# EAGLE design skill_test (EAGLE 9.6.1)
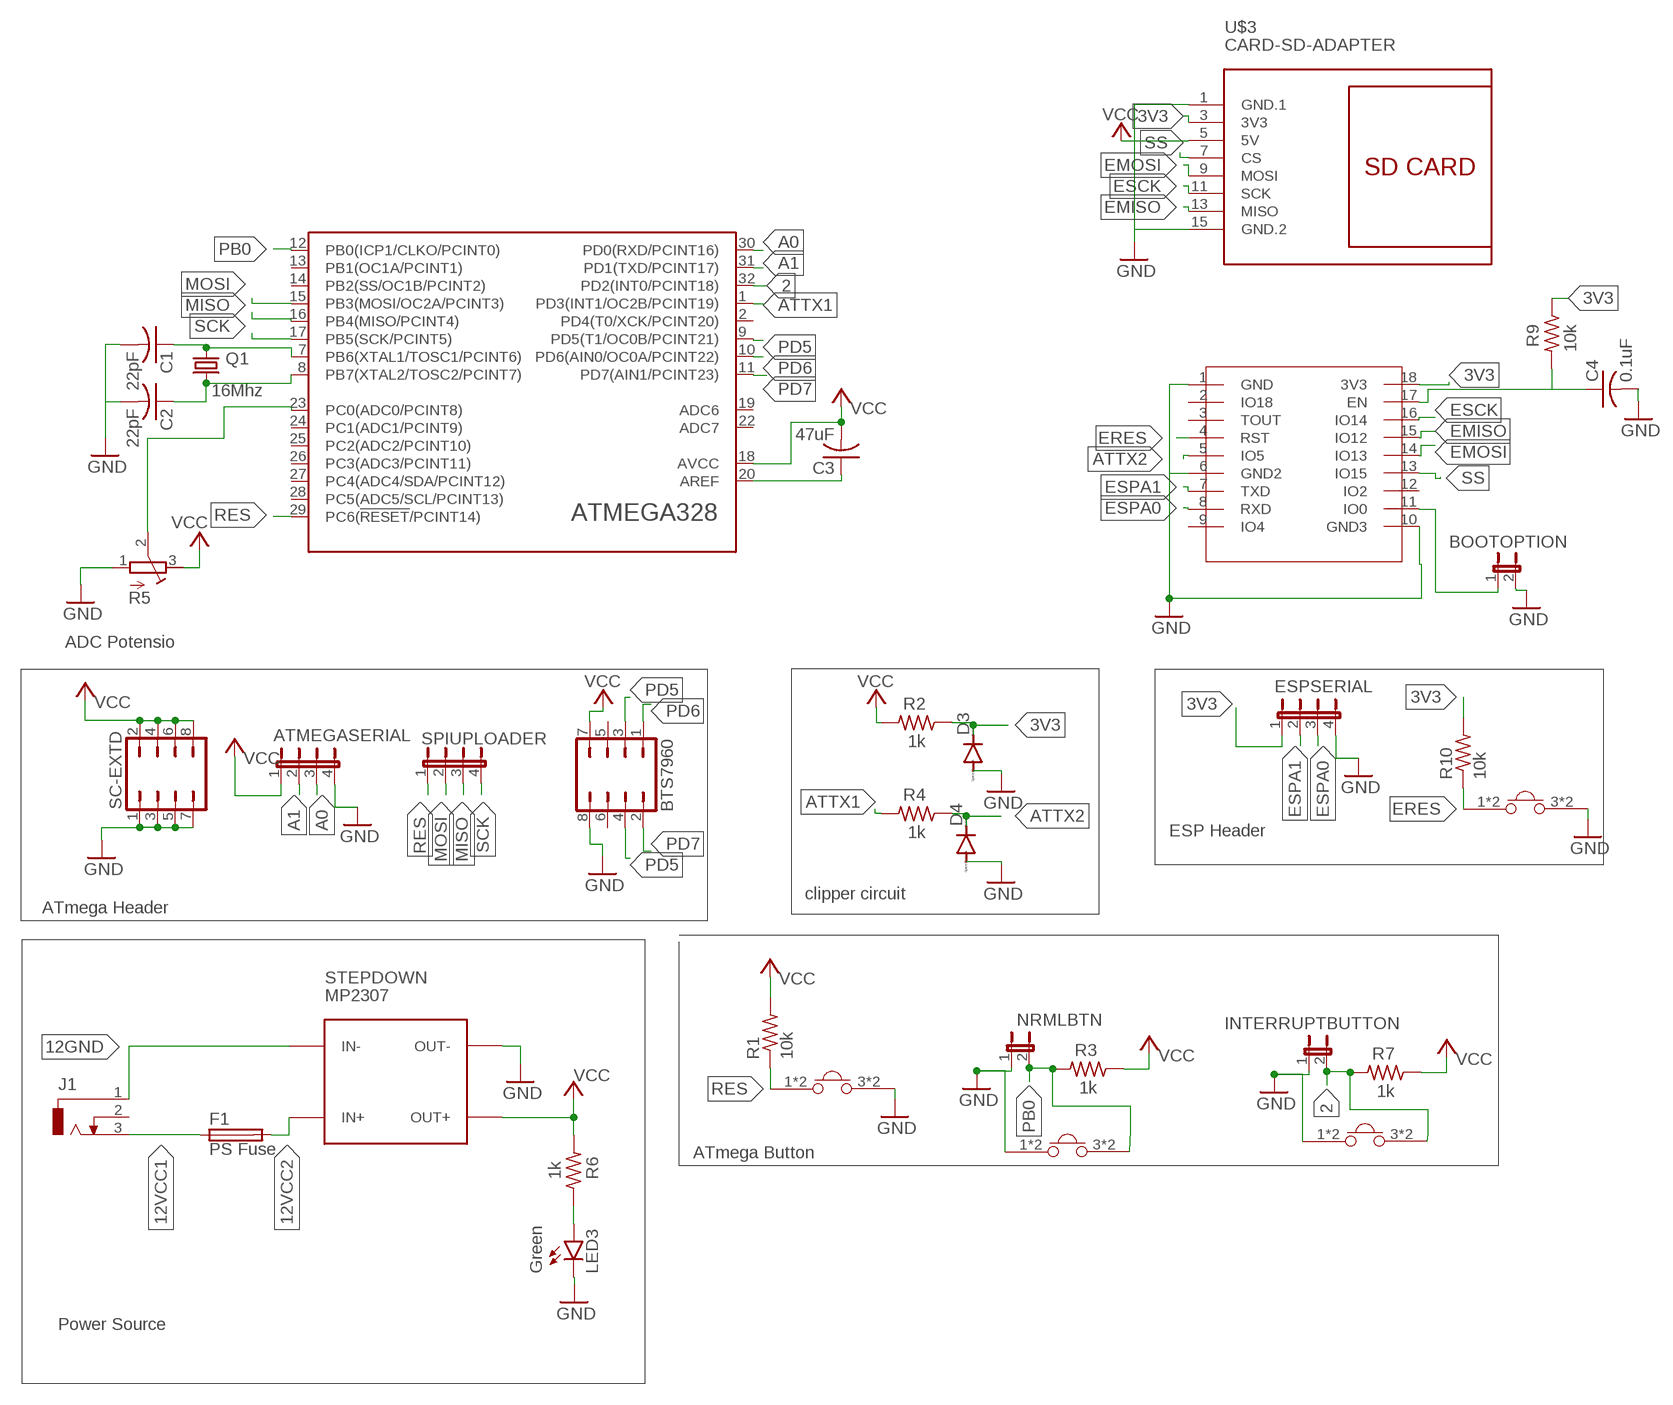
[diagram p0: schematic, sheet 1]

## Parts
2  SMD-PUSHBUTTON  [SMD-PUSHBUTTON]
ATMEGA328  ATMEGA48/88/168/328-AU  [TQFP32-08]
ATMEGASERIAL  JP4E  [JP4]
BOOTOPTION  JP1E  [JP1]
BTS7960  JP4Q  [JP4Q]
C1  22pF  C-USC0805  [C0805]
C2  22pF  C-USC0805  [C0805]
C3  47uF  C-USC0805  [C0805]
C4  0.1uF  C-US025-024X044  [C025-024X044]
D3  BAT81  [DO34-7]
D4  BAT81  [DO34-7]
ESPSERIAL  JP4E  [JP4]
F1  PS Fuse  FUSEBLANK_5X20MM  [FUSE_HOLDER_5X20MM]
INTERRUPTBUTTON  JP1E  [JP1]
J1  DCJ0303  [DCJ0303]
LED3  Green  LED3MM  [LED3MM]
NRMLBTN  JP1E  [JP1]
PB0  SMD-PUSHBUTTON  [SMD-PUSHBUTTON]
Q1  16Mhz  CRYSTALHC49UP  [HC49UP]
R1  10k  R-US_R0805  [R0805]
R2  1k  R-US_0204/7  [0204/7]
R3  1k  R-US_0204/7  [0204/7]
R4  1k  R-US_0204/7  [0204/7]
R5  R-TRIMM64W  [RTRIM64W]
R6  1k  R-US_0204/7  [0204/7]
R7  1k  R-US_0204/7  [0204/7]
R9  10k  R-US_0204/7  [0204/7]
R10  10k  R-US_R0805  [R0805]
RES  SMD-PUSHBUTTON  [SMD-PUSHBUTTON]
SC-EXTD  JP4Q  [JP4Q]
SPIUPLOADER  JP4E  [JP4]
STEPDOWN  MP2307  DC-DC-STEP-DOWN-MP2307  [DC-DC-STEP-DOWN-MP2307]
U$1  ESP-WROOM-02  [ESP-WROOM-02]
U$3  CARD-SD-ADAPTER  [CARD-SD-ADAPTER]
U$6  SMD-PUSHBUTTON  [SMD-PUSHBUTTON]

## Nets
2: 2.3 2.4 ATMEGA328.32(PD2(INT0/PCINT18)) INTERRUPTBUTTON.2 R7.2
3V3 [VCC]: D3.C ESPSERIAL.1 R2.1 R9.1 R10.2 U$1.18(3V3) U$3.3(3V3)
12GND [GND]: J1.1 STEPDOWN.IN-
12VCC1 [VCC]: F1.1 J1.3
12VCC2 [VCC]: F1.2 STEPDOWN.IN+
A0: ATMEGA328.30(PD0(RXD/PCINT16)) ATMEGASERIAL.3
A1: ATMEGA328.31(PD1(TXD/PCINT17)) ATMEGASERIAL.2
ATTX1: ATMEGA328.1(PD3(INT1/OC2B/PCINT19)) R4.2
ATTX2: D4.C R4.1 U$1.5(IO5)
EMISO: U$1.15(IO12) U$3.13(MISO)
EMOSI: U$1.14(IO13) U$3.9(MOSI)
ERES: R10.1 U$1.4(RST) U$6.1 U$6.2
ESCK: U$1.16(IO14) U$3.11(SCK)
ESPA0: ESPSERIAL.3 U$1.8(RXD)
ESPA1: ESPSERIAL.2 U$1.7(TXD)
GND [GND]: 2.1 2.2 ATMEGASERIAL.4 BOOTOPTION.2 BTS7960.8 C1.2 C2.2 C4.2 D3.A D4.A ESPSERIAL.4 INTERRUPTBUTTON.1 LED3.K(C) NRMLBTN.1 PB0.1 PB0.2 R5.1(A) RES.3 RES.4 SC-EXTD.1 SC-EXTD.3 SC-EXTD.5 SC-EXTD.7 STEPDOWN.OUT- U$1.1(GND) U$1.6(GND2) U$1.10(GND3) U$3.1(GND.1) U$3.15(GND.2) U$6.3 U$6.4
MISO: ATMEGA328.16(PB4(MISO/PCINT4)) SPIUPLOADER.3
MOSI: ATMEGA328.15(PB3(MOSI/OC2A/PCINT3)) SPIUPLOADER.2
N$1: LED3.A R6.1
N$5: ATMEGA328.20(AREF) C3.1
N$6: ATMEGA328.8(PB7(XTAL2/TOSC2/PCINT7)) C2.1 Q1.2
N$7: ATMEGA328.7(PB6(XTAL1/TOSC1/PCINT6)) C1.1 Q1.1
N$8: ATMEGA328.23(PC0(ADC0/PCINT8)) R5.2(S)
N$10: BOOTOPTION.1 U$1.11(IO0)
N$13: C4.1 R9.2 U$1.17(EN)
PB0: ATMEGA328.12(PB0(ICP1/CLKO/PCINT0)) NRMLBTN.2 PB0.3 PB0.4 R3.2
PD5: ATMEGA328.9(PD5(T1/OC0B/PCINT21)) BTS7960.3 BTS7960.4
PD6: ATMEGA328.10(PD6(AIN0/OC0A/PCINT22)) BTS7960.1
PD7: ATMEGA328.11(PD7(AIN1/PCINT23)) BTS7960.2
RES: ATMEGA328.29(PC6(!RESET!/PCINT14)) R1.1 RES.1 RES.2 SPIUPLOADER.1
SCK: ATMEGA328.17(PB5(SCK/PCINT5)) SPIUPLOADER.4
SS: U$1.13(IO15) U$3.7(CS)
VCC [VCC]: ATMEGA328.18(AVCC) ATMEGASERIAL.1 BTS7960.7 C3.2 R1.2 R2.2 R3.1 R5.3(E) R6.2 R7.1 SC-EXTD.2 SC-EXTD.4 SC-EXTD.6 SC-EXTD.8 STEPDOWN.OUT+ U$3.5(5V)
Unconnected: ATMEGA328.2(PD4(T0/XCK/PCINT20)) ATMEGA328.13(PB1(OC1A/PCINT1)) ATMEGA328.14(PB2(SS/OC1B/PCINT2)) ATMEGA328.19(ADC6) ATMEGA328.22(ADC7) ATMEGA328.24(PC1(ADC1/PCINT9)) ATMEGA328.25(PC2(ADC2/PCINT10)) ATMEGA328.26(PC3(ADC3/PCINT11)) ATMEGA328.27(PC4(ADC4/SDA/PCINT12)) ATMEGA328.28(PC5(ADC5/SCL/PCINT13)) BTS7960.5 BTS7960.6 J1.2 U$1.2(IO18) U$1.3(TOUT) U$1.9(IO4) U$1.12(IO2)

## Notes on the sheet
- ADC Potensio
- ESP Header
- clipper circuit
- ATmega Header
- ATmega Button
- Power Source

## Power pins joined to a net without a drawn wire
GND: ATMEGA328.3(GND) ATMEGA328.5(GND) ATMEGA328.21(GND)
UCC: ATMEGA328.4(UCC) ATMEGA328.6(UCC)

## Library data of the parts
2 PB0 RES U$6 = additionlib:SMD-PUSHBUTTON
ATMEGA328 = atmega328:ATMEGA48/88/168/328
ATMEGASERIAL ESPSERIAL SPIUPLOADER = jumper:JP4E: JUMPER
BOOTOPTION INTERRUPTBUTTON NRMLBTN = jumper:JP1E: JUMPER
BTS7960 SC-EXTD = jumper:JP4Q: JUMPER
C1-C4 = rcl:C-US: CAPACITOR, American symbol; SPICEPREFIX: C
D3 D4 = diode:BAT81: DIODE barrier diode
F1 = fuse:FUSE: Fuse; OC_FARNELL: unknown; OC_NEWARK: unknown
J1 = con-jack:DCJ0303: DC POWER JACK Source: DCJ0303.pdf; OC_FARNELL: unknown; OC_NEWARK: unknown
LED3 = led:LED: LED OSRAM: - CHIPLED LG R971, LG N971, LY N971, LG Q971, LY Q971, LO R971, LY R971 LH N974, LH R974 LS Q976, LO Q976, LY Q976 LO Q996 - Hyper CHIPLED LW Q18S LB Q993, LB Q99A, LB R99A - SideLED LS A670, LO A670, LY A670, LG A670, LP A670 LB A673, LV A673, LT A673, LW A673 LH A674 LY A675 LS A676, LA A676, LO A676, LY A676, LW A676 LS A679, LY A679, LG A679 - Hyper Micro SIDELED® LS Y876, LA Y876, LO Y876, LY Y876 LT Y87S - SmartLED LW L88C, LW L88S LB L89C, LB L89S, LG L890 LS L89K, LO L89K, LY L89K LS L896, LA L896, LO L896, LY L896 - TOPLED LS T670, LO T670, LY T670, LG T670, LP T670 LSG T670, LSP T670, LSY T670, LOP T670, LYG T670 LG T671, LOG T671, LSG T671 LB T673, LV T673, LT T673, LW T673 LH T674 LS T676, LA T676, LO T676, LY T676, LB T676, LH T676, LSB T676, LW T676 LB T67C, LV T67C, LT T67C, LS T67K, LO T67K, LY T67K, LW E67C LS E67B, LA E67B, LO E67B, LY E67B, LB E67C, LV E67C, LT E67C LW T67C LS T679, LY T679, LG T679 LS T770, LO T770, LY T770, LG T770, LP T770 LB T773, LV T773, LT T773, LW T773 LH T774 LS E675, LA E675, LY E675, LS T675 LS T776, LA T776, LO T776, LY T776, LB T776 LHGB T686 LT T68C, LB T68C - Hyper Mini TOPLED® LB M676 - Mini TOPLED Santana® LG M470 LS M47K, LO M47K, LY M47K Source: http://www.osram.convergy.de LUXEON: - LUMILED® LXK2-PW12-R00, LXK2-PW12-S00, LXK2-PW14-U00, LXK2-PW14-V00 LXK2-PM12-R00, LXK2-PM12-S00, LXK2-PM14-U00 LXK2-PE12-Q00, LXK2-PE12-R00, LXK2-PE12-S00, LXK2-PE14-T00, LXK2-PE14-U00 LXK2-PB12-K00, LXK2-PB12-L00, LXK2-PB12-M00, LXK2-PB14-N00, LXK2-PB14-P00, LXK2-PB14-Q00 LXK2-PR12-L00, LXK2-PR12-M00, LXK2-PR14-Q00, LXK2-PR14-R00 LXK2-PD12-Q00, LXK2-PD12-R00, LXK2-PD12-S00 LXK2-PH12-R00, LXK2-PH12-S00 LXK2-PL12-P00, LXK2-PL12-Q00, LXK2-PL12-R00 Source: www.luxeon.com KINGBRIGHT: KA-3528ASYC Source: www.kingbright.com
Q1 = crystal:CRYSTAL: CRYSTAL; OC_FARNELL: unknown; OC_NEWARK: unknown
R1-R4 R6 R7 R9 R10 = rcl:R-US_: RESISTOR, American symbol; SPICEPREFIX: R
R5 = rcl:R-TRIMM: Trimm resistor; SPICEMODEL: X; SPICEPREFIXL: POT
STEPDOWN = diy-modules:DC-DC-STEP-DOWN-MP2307: DC/DC Step-Down Regulator based on MP2307DN chip MP2307 datasheet available here: https://cdn-shop.adafruit.com/datasheets/MP2307_r1.9.pdf Click here to find device on ebay.com <http://www.ebay.com/sch/dc+dc+3a+mini+converter>
U$1 = additionlib:ESP-WROOM-02
U$3 = diy-modules:CARD-SD-ADAPTER: Full Size SD Card Adapter Module with onboard 3.3V regulator Guide describing how to use SD card with Arduino is available here: https://www.arduino.cc/en/Reference/SDCardNotes Click here to find device on ebay.com <http://www.ebay.com/sch/sd+card+socket+module>

## Net classes
0 default: width 0.254 mm, clearance 0.254 mm
1 GND: width 0.381 mm, clearance 0.254 mm
2 VCC: width 0.381 mm, clearance 0.254 mm

## Board
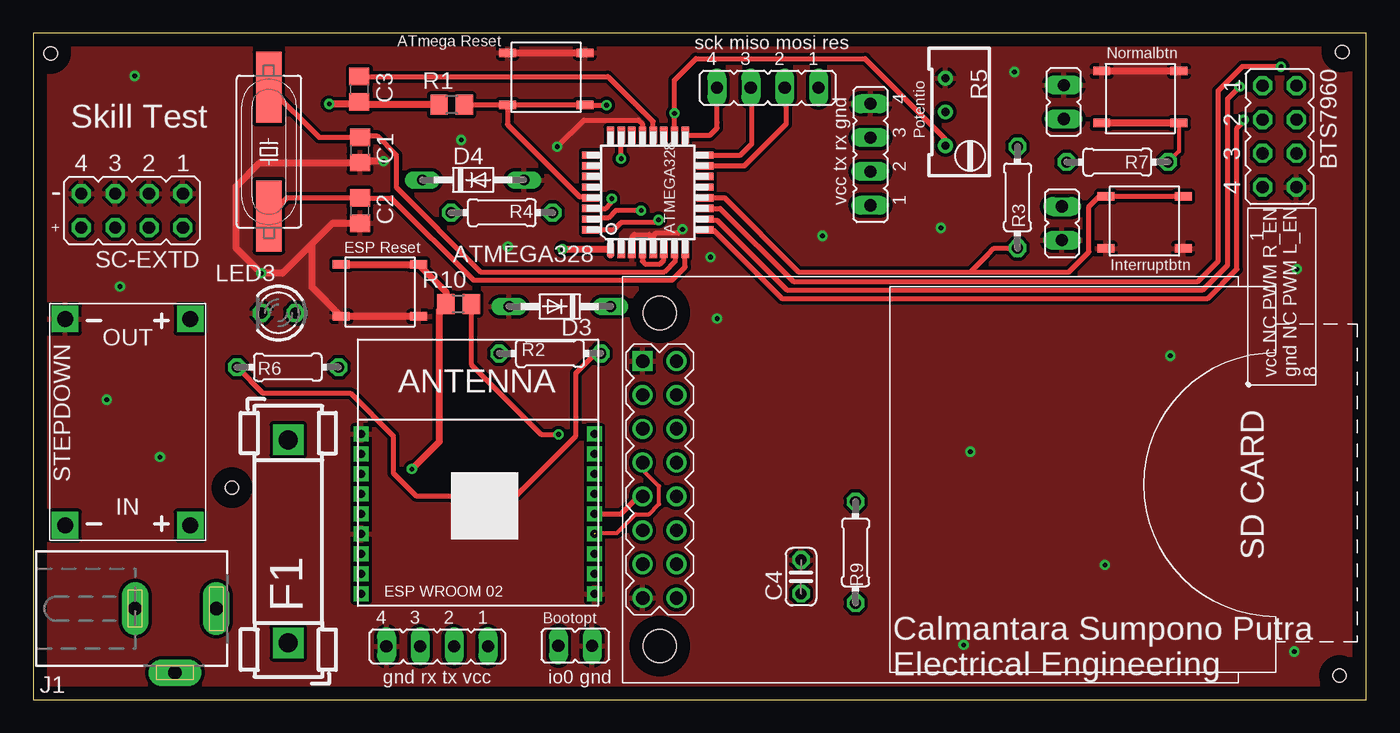
[diagram p1: board, top side]
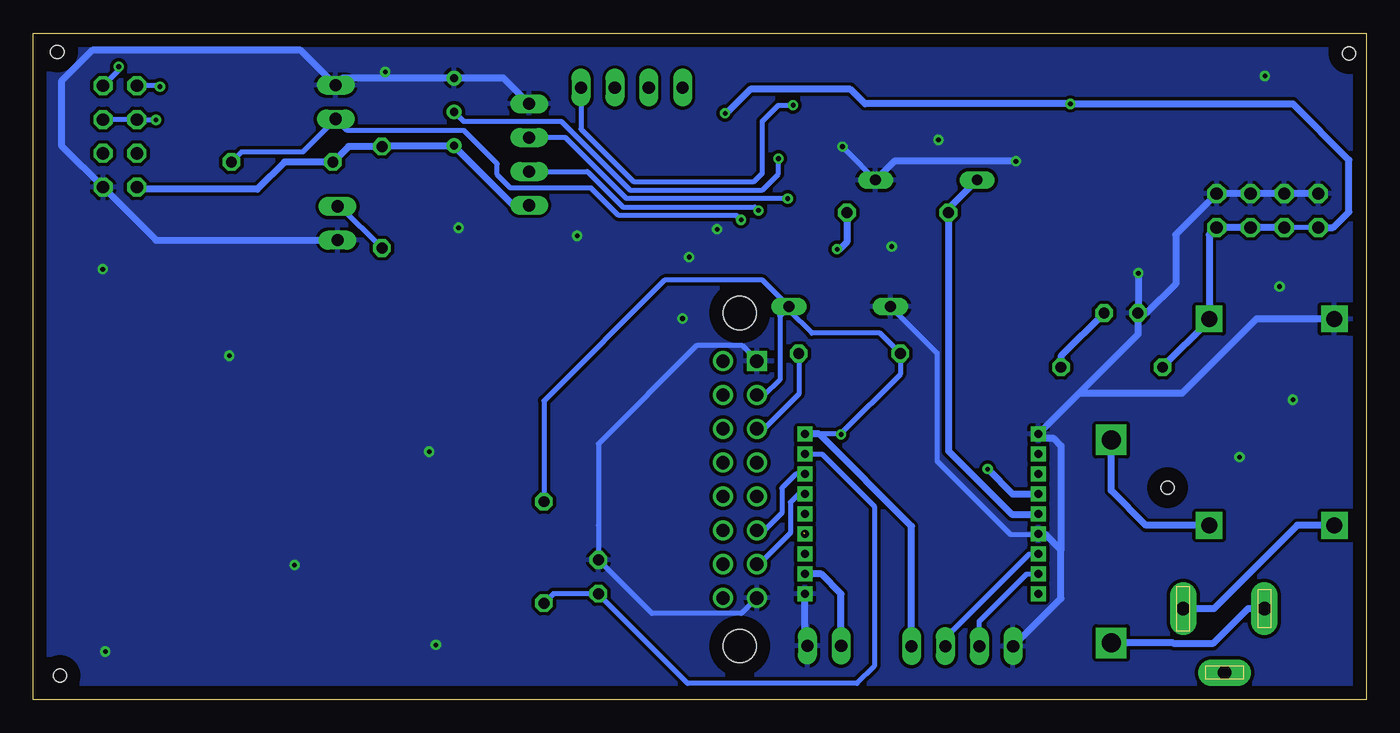
[diagram p2: board, bottom side, seen from below]

Size 100 x 50 mm. Coordinates in mm from the lower left corner, seen from the top.
Outline: 0,0 100,0 100,50 0,50 0,0
Copper layers (1*16): Top 0.035mm / dielectric 1.5mm / Bottom 0.035mm
Design rules "default": minimum track width 6mil, minimum drill 0.35mm, track to track 6mil, track to pad 6mil, pad to pad 6mil, via to via 6mil, smd to smd 6mil, copper to edge 40mil, drill to drill 6mil, minimum pad ring 10mil, minimum via ring 8mil, stop-mask expansion 4mil, vias tented up to drill 0mil, thermal gap 10mil
Holes 1 mm at 98,1.8 98.2,48.6 1.3,48.5 14.9,15.9

### Footprints (pad centres in the part's own frame; a part is rotated, then mirrored left to right if it is on the bottom)
SMD-PUSHBUTTON = smd 1.27 x 0.635: 1 -2.3,2.45; 2 3.5,2.45; 3 -2.3,-1.45; 4 3.5,-1.45
TQFP32-08 = smd 1.27 x 0.55: 1 -4.293,2.8; 2 -4.293,2; 3 -4.293,1.2; 4 -4.293,0.4; 5 -4.293,-0.4; 6 -4.293,-1.2; 7 -4.293,-2; 8 -4.293,-2.8; 17 4.293,-2.8; 18 4.293,-2; 19 4.293,-1.2; 20 4.293,-0.4; 21 4.293,0.4; 22 4.293,1.2; 23 4.293,2; 24 4.293,2.8 | smd 0.55 x 1.27: 9 -2.8,-4.293; 10 -2,-4.293; 11 -1.2,-4.293; 12 -0.4,-4.293; 13 0.4,-4.293; 14 1.2,-4.293; 15 2,-4.293; 16 2.8,-4.293; 25 2.8,4.293; 26 2,4.293; 27 1.2,4.293; 28 0.4,4.293; 29 -0.4,4.293; 30 -1.2,4.293; 31 -2,4.293; 32 -2.8,4.293
JP4 = drill 0.914 long: 1 -3.81,0; 2 -1.27,0; 3 1.27,0; 4 3.81,0
JP1 = drill 0.914 long: 1 0,-1.27; 2 0,1.27
JP4Q = drill 0.914 octagon: 1 -3.81,-1.27; 2 -3.81,1.27; 3 -1.27,-1.27; 4 -1.27,1.27; 5 1.27,-1.27; 6 1.27,1.27; 7 3.81,-1.27; 8 3.81,1.27
C0805 = smd 1.3 x 1.5: 1 -0.95,0; 2 0.95,0
C025-024X044 = drill 0.813 octagon: 1 -1.27,0; 2 1.27,0
DO34-7 = drill 0.813 long: A 3.81,0; C -3.81,0
FUSE_HOLDER_5X20MM = drill 1.422 pad 2.286 square: 1 0,0; 2 15.24,0
DCJ0303 = drill 1 pad 2 long: 1 0,3.1; 2 4.8,0; 3 0,-3
LED3MM = drill 0.813 octagon: A -1.27,0; K 1.27,0
HC49UP = smd 5.334 x 1.93: 1 -4.826,0; 2 4.826,0
R0805 = smd 1.3 x 1.5: 1 -0.95,0; 2 0.95,0
0204/7 = drill 0.813 octagon: 1 -3.81,0; 2 3.81,0
RTRIM64W = drill 0.61: 1 1.27,-2.54; 2 1.27,0; 3 1.27,2.54
DC-DC-STEP-DOWN-MP2307 = drill 1.2 pad 2 square: IN+ -7.747,-4.699; IN- -7.747,4.699; OUT+ 7.747,-4.699; OUT- 7.747,4.699
ESP-WROOM-02 = drill 0.6 square: 1 -7.75,-4.1; 2 -7.75,-5.6; 3 -7.75,-7.1; 4 -7.75,-8.6; 5 -7.75,-10.1; 6 -7.75,-11.6; 7 -7.75,-13.1; 8 -7.75,-14.6; 9 -7.75,-16.1; 10 9.75,-16.1; 11 9.75,-14.6; 12 9.75,-13.1; 13 9.75,-11.6; 14 9.75,-10.1; 15 9.75,-8.6; 16 9.75,-7.1; 17 9.75,-5.6; 18 9.75,-4.1
CARD-SD-ADAPTER = drill 1 square: 1 -21.59,8.89 | drill 1: 2 -19.05,8.89; 3 -21.59,6.35; 4 -19.05,6.35; 5 -21.59,3.81; 6 -19.05,3.81; 7 -21.59,1.27; 8 -19.05,1.27; 9 -21.59,-1.27; 10 -19.05,-1.27; 11 -21.59,-3.81; 12 -19.05,-3.81; 13 -21.59,-6.35; 14 -19.05,-6.35; 15 -21.59,-8.89; 16 -19.05,-8.89 | hole 2.5: -20.32,12.5; -20.32,-12.5

### Placement (x,y rotation side)
2  82.45,44.71 0 top
ATMEGA328  46.1,38.06 90 top
ATMEGASERIAL  62.8,40.9 90 top
BOOTOPTION  40.66,4.03 270 top
BTS7960  93.5,42.26 270 top
C1  24.5,41.24 270 top
C2  24.5,36.69 270 top
C3  24.46,45.81 270 top
C4  57.6,9.21 90 top
D3  39.5,29.5 180 top
D4  33,39 0 top
ESPSERIAL  30.3,4 180 top
F1  19.13,4.25 90 top
INTERRUPTBUTTON  77.31,44.84 180 top
J1  10.63,6.82 270 top
LED3  18.39,29.01 180 top
NRMLBTN  77.18,35.74 0 top
PB0  83.97,36.31 180 top
Q1  17.67,41.12 270 top
R1  31.39,44.64 180 top
R2  38.76,25.97 0 top
R3  73.84,37.69 270 top
R4  35.15,36.54 0 top
R5  69.7,44.1 180 top
R6  19.09,24.94 180 top
R7  81.33,40.34 0 top
R9  61.69,11.04 270 top
R10  31.9,29.7 0 top
RES  39.08,47.09 180 top
SC-EXTD  7.41,36.7 180 top
SPIUPLOADER  55.1,45.93 180 top
STEPDOWN  7.08,20.82 90 top
U$1  32.35,24.03 0 top
U$3  67.31,16.51 0 top
U$6  25.4,30.2 0 top

### Tracks (layer width: path | path; a pad name or v marks a point on that pad's centre or on a via)
2  (via drill 0.35)
  Top 0.305: 2.4 85.95,41.15 R7.2
  Top 0.381: ATMEGA328.32 43.56,35.26 44.1,35.8 46.7,35.8 v46.9,36
  Top 0.508: 2.4 2.3
  Bottom 0.381: v46.9,36 47.23,36.33 56.08,36.33 58.15,38.4 64.2,38.4 65.2,39.4 65.2,40.2 67.7,42.7 76.44,42.7 INTERRUPTBUTTON.2 79.78,41.1 84.38,41.1 R7.2
3V3  (via drill 0.35)
  Top 0.381: R10.2 32.85,25.15 38.1,19.9 v39.4,19.9
  Bottom 0.381: v39.4,19.9 39.43,19.93 | 39.43,19.93 U$1.18 | U$3.3 45.14,22.86 44,24 44,28.8 D3.C | D3.C 43.31,29.21 41.6,27.5 36.48,27.5 R2.1 34.95,24.41 39.43,19.93 | D3.C | D3.C 45.29,31.47 52.63,31.47 61.69,22.41 R9.1
  Bottom 0.508: ESPSERIAL.1 34.11,13.01 41.03,19.93 U$1.18
12GND
  Bottom 0.508: STEPDOWN.IN- 5.18,13.07 11.43,6.82 J1.1
12VCC1
  Bottom 0.508: J1.3 8.88,6.82 11.52,4.18 14.41,4.18 14.47,4.25 F1.1
12VCC2
  Bottom 0.508: STEPDOWN.IN+ 16.51,13.07 19.13,15.69 F1.2
A0  (via drill 0.35)
  Top 0.381: ATMEGA328.30 42.96,36.86 43.3,37.2 43.3,37.5 v43.4,37.6
  Bottom 0.381: v43.4,37.6 55.5,37.6 60.07,42.17 ATMEGASERIAL.3
A1  (via drill 0.35)
  Top 0.381: v45.6,36.7 43.7,36.7 43.14,36.14 41.89,36.14 ATMEGA328.31
  Bottom 0.381: ATMEGASERIAL.2 58.43,39.63 55.77,36.97 45.87,36.97 v45.6,36.7
ATTX1  (via drill 0.35)
  Top 0.508: v39.7,33.8 43.27,33.8 ATMEGA328.1
  Bottom 0.508: R4.2 38.96,34.34 39.5,33.8 v39.7,33.8
ATTX2
  Bottom 0.508: D4.C 31.34,36.85 R4.1 31.34,18.64 26.6,13.9 24.63,13.9 U$1.5
EMISO
  Bottom 0.381: U$1.15 42.57,15.43 43.2,14.8 43.2,12.5 45.54,10.16 U$3.13
EMOSI
  Top 0.381: U$1.14 44.11,13.93 45.42,15.24 U$3.9
ERES  (via drill 0.35)
  Top 0.508: U$6.1 U$6.2 30.95,30.6 R10.1 30.45,29.2 30.45,19.35 v28.4,17.3
  Bottom 0.508: v28.4,17.3 26.53,15.43 U$1.4
ESCK
  Bottom 0.381: U$1.16 42.77,16.93 43.84,15.87 43.84,14 45.13,12.7 U$3.11
ESPA0
  Bottom 0.381: ESPSERIAL.3 29.03,5.87 25.47,9.43 U$1.8
ESPA1
  Bottom 0.381: ESPSERIAL.2 31.57,4.63 25.27,10.93 U$1.7
GND  (via drill 0.35)
  Top 0.381: v39.3,41.5 41.3,43.5 45.4,43.5 45.7,43.2 ATMEGA328.21 | ATMEGA328.3 44.9,34.7 45.1,34.9 46.2,34.9 46.35,34.75 | ATMEGA328.5 46.5,34.6 46.35,34.75 | 46.35,34.75 46.45,34.75 46.7,35 48.4,35 v48.7,35.3
  Top 0.508: U$6.4 U$6.3 20.9,30.95 20.9,34.2 | RES.4 RES.3 | 2.2 2.1 | C2.2 22.44,35.74 20.9,34.2 | 20.9,34.2 18.7,32 v17.1,32 15.2,33.9 15.2,38.5 16.99,40.29 C1.2 24.61,40.4 v26.27,40.4
  Bottom 0.381: 41.93,3.03 BOOTOPTION.2 | D4.A 38.9,41.09 38.9,41.1 v39.3,41.5 | U$3.15 46.87,6.47 53.59,6.47 C4.2 | D3.A 32.2,26.01 32.2,17.9 26.7,12.4 24.63,12.4 U$1.6 | 57.6,13.1 C4.2 | U$3.1 45.72,25.47 46.8,26.55 50.25,26.55 57.6,19.2 C4.2
  Bottom 0.508: NRMLBTN.1 90.79,34.47 BTS7960.8 97.9,41.58 97.9,46.4 95.57,48.73 79.93,48.73 INTERRUPTBUTTON.1 76.78,46.64 R5.1 64.73,46.64 ATMEGASERIAL.4 | SC-EXTD.7 SC-EXTD.1 14.3,34.89 14.3,31.2 16.49,29.01 LED3.K | BOOTOPTION.2 42.1,4.2 U$1.10 | ESPSERIAL.4 22.9,7.59 22.9,11.24 | 22.9,11.24 24.09,12.43 U$1.6 | 22.9,11.24 22.9,19.04 23.48,19.62 24.29,19.62 U$1.1 21.53,23 | 21.53,23 13.8,23 8.23,28.57 STEPDOWN.OUT- | LED3.K 17.1,29.03 v17.1,32 | D4.A 35.41,40.4 v26.27,40.4 | LED3.K 17.12,27.41 21.53,23
  other vias: 51.3,28.6 50.8,33.2 32.1,42 7.6,46.8 6.5,31 5.5,22.5 9.5,18.2 70.3,18.6 35.6,34 59.2,34.8 68.1,35.4 73.6,47.1 85.3,25.8 94.8,32.3 69.8,4.1 80.4,10.1 94.6,3.6
  pour Bottom: 101.1,50.9 101.2,51 101.2,-0.1 -0.9,-0.1 -1.7,0.7 -1.7,50.3
  pour Top: -1.5,51.6 100.8,51.6 102,50.4 102.5,49.9 102.5,-0.5 101.4,-1.6 -1.5,-1.6 -1.5,51.5
MISO
  Top 0.381: ATMEGA328.16 53.06,40.86 53.9,41.7 53.9,43.4
  Top 0.384: 53.9,43.4 53.9,45.86 SPIUPLOADER.3
  Bottom 0.381: 53.9,45.86 SPIUPLOADER.3
MOSI
  Top 0.381: ATMEGA328.15 53.36,40.06 56.5,43.2 56.5,43.3
  Top 0.384: 56.5,43.3 56.5,45.8 SPIUPLOADER.2
  Bottom 0.381: 56.5,45.8 SPIUPLOADER.2
N$1
  Bottom 0.508: LED3.A 22.9,25.77 R6.1
N$5
  Top 0.381: C3.1 43.11,46.76 46.5,43.37 ATMEGA328.20
N$6
  Top 0.381: ATMEGA328.8 48.9,32.47 47.9,31.47 33.03,31.47 26.86,37.64 C2.1 19.02,37.64 Q1.2
N$7
  Top 0.381: Q1.1 21.43,42.19 C1.1 24.62,42.31 25.79,42.31 27.23,40.87 27.23,38.44 33.57,32.1 47.35,32.1 48.15,32.9 48.15,33.72 ATMEGA328.7
N$8  (via drill 0.35)
  Top 0.381: v44.1,40.6 ATMEGA328.23
  Bottom 0.381: R5.2 67.73,43.4 60.4,43.4 55.23,38.23 45.3,38.23 44.1,39.44 v44.1,40.6
N$10
  Bottom 0.508: U$1.11 42.09,9.42 40.88,9.42 39.39,7.93 BOOTOPTION.1
N$13
  Bottom 0.381: R9.2 60.98,7.94 C4.1 57.6,7.9 50.91,1.21 38.19,1.21 36.9,2.5 36.9,14.5 40.83,18.43 U$1.17
PB0
  Top 0.381: ATMEGA328.12 51.84,37.66 57.4,32.1 70.3,32.1 | 70.3,32.1 71.6,33.4 72.08,33.88 | 70.3,32.1 77.7,32.1 79.2,33.6 79.2,37 79.96,37.76 PB0.4 PB0.3
  Top 0.384: 72.08,33.88 R3.2
  Bottom 0.381: R3.2 76.97,37.01
  Bottom 0.508: 76.97,37.01 NRMLBTN.2
PD5  (via drill 0.35)
  Top 0.381: ATMEGA328.9 50.99,35.26 56.15,30.1 88.1,30.1 90.3,32.3 90.3,42.9 90.8,43.4 v90.8,43.5
  Bottom 0.381: v90.8,43.5 92.2,43.5 BTS7960.3 BTS7960.4
PD6  (via drill 0.35)
  Top 0.381: ATMEGA328.10 50.47,35.98 51.31,35.98 56.56,30.73 87.73,30.73 89.6,32.6 89.6,45.1 v90.5,46
  Bottom 0.381: v90.5,46 90.57,46.07 BTS7960.1
PD7  (via drill 0.35)
  Top 0.381: ATMEGA328.11 51.53,36.86 57.02,31.37 87.37,31.37 88.9,32.9 88.9,45.7 90.7,47.5 v93.6,47.5
  Bottom 0.381: v93.6,47.5 93.6,47.24 BTS7960.2
RES  (via drill 0.35)
  Top 0.381: R1.1 RES.2 | RES.2 35.58,43.15 40.99,37.74 41.73,37.74 ATMEGA328.29 | RES.2 RES.1 41.42,44.6 v43,44.6
  Bottom 0.381: SPIUPLOADER.1 58.91,42.81 54.97,38.87 45.93,38.87 45.3,39.5 45.3,43.4 44.1,44.6 v43,44.6
SCK
  Top 0.381: ATMEGA328.17 50.75,42.35 51.3,42.9 51.3,43.3
  Top 0.384: 51.3,43.3 SPIUPLOADER.4
  Bottom 0.381: SPIUPLOADER.4
SS  (1 unrouted)
  Top 0.305: U$3.7 45.72,17.25 46.95,16.01 46.95,14.67 46.19,13.9 45.19,13.9 43.78,12.49 42.16,12.49
UCC
  Top 0.381: ATMEGA328.4 45.7,32.9 45.9,32.7 47,32.7 47.3,33 ATMEGA328.6
VCC  (via drill 0.35)
  Top 0.381: ATMEGA328.18 v48.1,44 48.1,46.5 49.7,48.1 62.4,48.1 68.43,42.07 R5.3 | R6.2 17.22,23 23.8,23 27,19.8 27,17 28.7,15.3 36.2,15.3 40.7,19.8 40.7,24.5 42.17,25.97 R2.2
  Top 0.508: R1.2 24.68,44.64 C3.2 24.3,44.7 v22.2,44.7
  Bottom 0.381: R2.2 42.57,22.93 45.18,20.32 U$3.5 | 6.5,35.43 SC-EXTD.6 SC-EXTD.8 | SC-EXTD.4 SC-EXTD.2
  Bottom 0.508: BTS7960.7 92.08,38.3 83.2,38.3 81.16,40.34 R7.1 76.36,41.5 R3.1 73.78,41.56 R5.3 68.43,41.53 63.99,37.09 ATMEGASERIAL.1 | 6.5,35.43 SC-EXTD.2 11.78,34.87 STEPDOWN.OUT+ 11.78,28.44 R6.2 | SC-EXTD.8 2.47,35.43 1.3,36.6 1.3,40.5 5.5,44.7 v22.2,44.7 37.6,44.7 38.7,45.8 46.2,45.8 48,44 v48.1,44

### Text on the board
tPlace: ATmega Reset | sck miso mosi res | Normalbtn | Skill Test | Potentio | - | - | vcc tx rx gnd | + | ESP Reset | 1 | Interruptbtn | vcc NC PWM R_EN / gnd NC PWM L_EN | 8 | ESP WROOM 02 | Bootopt | Calmantara Sumpono Putra / Electrical Engineering | gnd rx tx vcc | io0 gnd